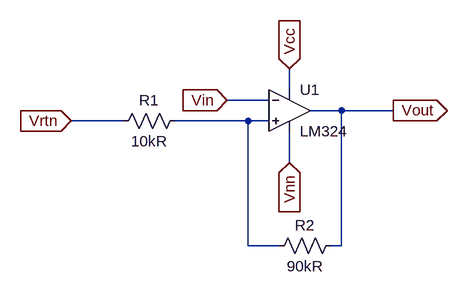
[diagram p0: schematic InvertingOpamp.asc]
InvertingOpamp.asc, the LTspice schematic file:
Version 4.1
SHEET 1 880 680
WIRE 496 336 496 304
WIRE 464 352 400 352
WIRE 576 368 528 368
WIRE 656 368 576 368
WIRE 240 384 160 384
WIRE 432 384 320 384
WIRE 464 384 432 384
WIRE 496 448 496 400
WIRE 432 576 432 384
WIRE 480 576 432 576
WIRE 576 576 576 368
WIRE 576 576 560 576
FLAG 160 384 Vrtn
IOPIN 160 384 In
FLAG 400 352 Vin
IOPIN 400 352 In
FLAG 496 304 Vcc
IOPIN 496 304 In
FLAG 496 448 Vnn
IOPIN 496 448 In
FLAG 656 368 Vout
IOPIN 656 368 Out
SYMBOL res 336 368 R90
WINDOW 0 0 56 VBottom 2
WINDOW 3 32 56 VTop 2
SYMATTR InstName R1
SYMATTR Value 10kR
SYMBOL LM324 496 368 R0
SYMATTR InstName U1
SYMBOL res 576 560 R90
WINDOW 0 0 56 VBottom 2
WINDOW 3 32 56 VTop 2
SYMATTR InstName R2
SYMATTR Value 90kR

The netlist it stands for:
* InvertingOpamp.asc
R1 N001 Vrtn 10kR
* U1: LM324 (symbol LM324 not available, pins judged from their places): In+=N001 In-=Vin V+=Vcc V-=Vnn OUT=Vout
R2 Vout N001 90kR
.backanno
.end